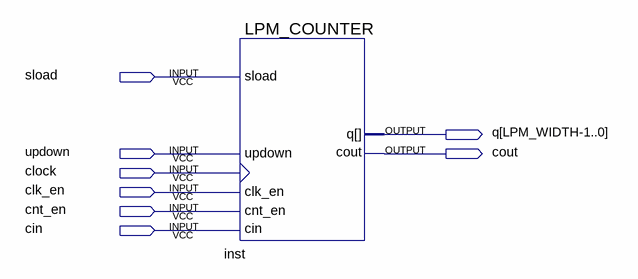
[diagram p0: schematic sheet]
// Quartus schematic Block2.bdf as structural Verilog: 1 symbols, 8 pins
module Block2 (
  input  sload,
  input  updown,
  input  clock,
  input  clk_en,
  input  cnt_en,
  input  cin,
  output \q[LPM_WIDTH-1..0] ,
  output cout
);

  LPM_COUNTER inst (
    .cin(cin), .clk_en(clk_en), .clock(clock), .cnt_en(cnt_en), .sload(sload), .updown(updown), .cout(cout),
    .q(\q[LPM_WIDTH-1..0] ));
endmodule
